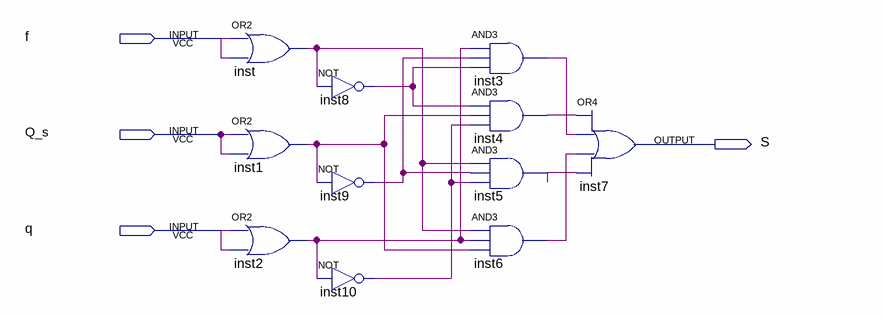
[diagram p0: schematic sheet]
// Quartus schematic sm_s.bdf as structural Verilog: 11 symbols, 4 pins
module sm_s (
  input  f,
  input  Q_s,
  input  q,
  output S
);

  wire inst1_out, inst2_out, inst3_out, inst4_out, inst5_out, inst6_out, inst8_out, inst9_out, inst10_out,
       inst_out;

  or inst (inst_out, f, f);
  or inst1 (inst1_out, Q_s, Q_s);
  or inst2 (inst2_out, q, q);
  not inst8 (inst8_out, inst_out);
  not inst9 (inst9_out, inst1_out);
  not inst10 (inst10_out, inst2_out);
  and inst3 (inst3_out, inst2_out, inst9_out, inst8_out);
  and inst4 (inst4_out, inst8_out, inst1_out, inst10_out);
  and inst5 (inst5_out, inst_out, inst9_out, inst10_out);
  and inst6 (inst6_out, inst_out, inst2_out, inst1_out);
  or inst7 (S, inst4_out, inst3_out, inst6_out, inst5_out);
endmodule
